# EAGLE board EEZ DIB DCP405 r2B6 (EAGLE 7.2.0), part 1 of 2
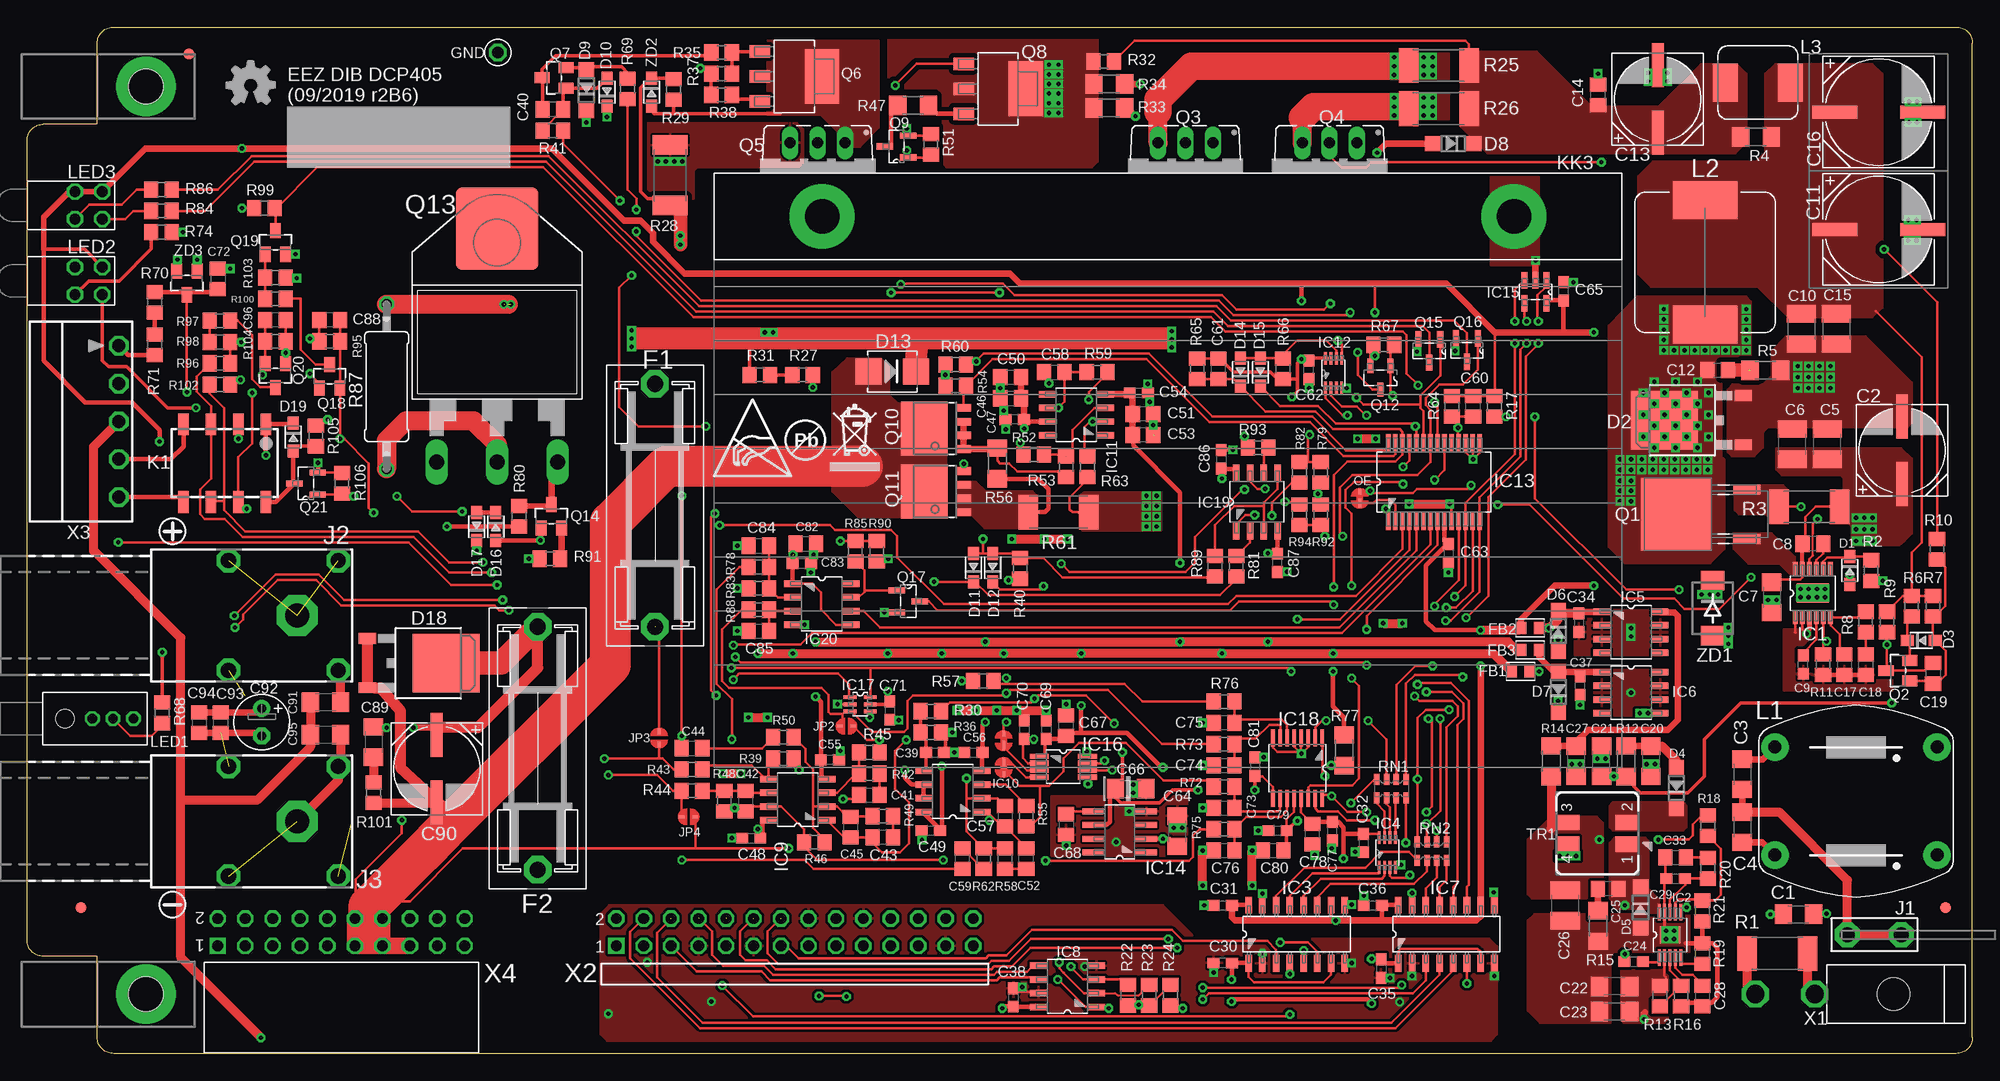
[diagram p6: board, top side]
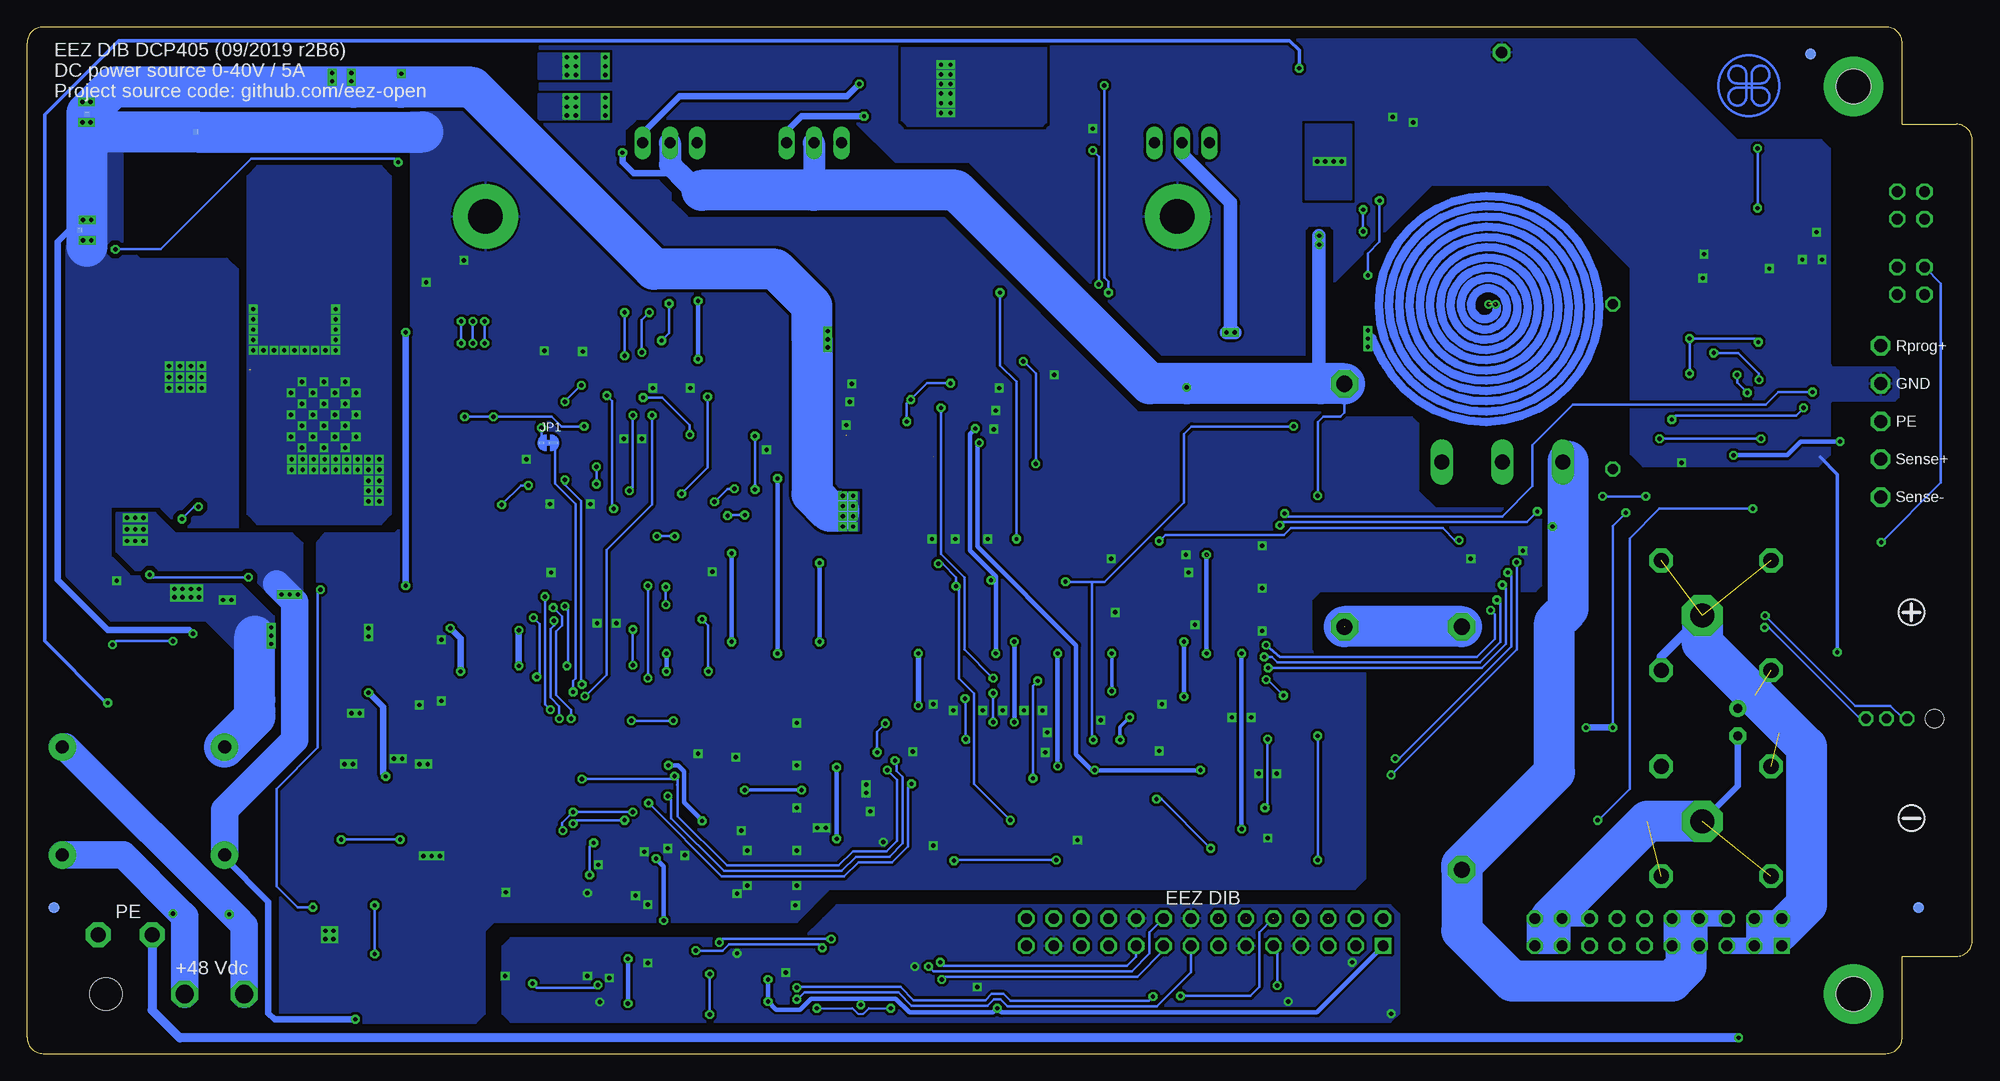
[diagram p7: board, bottom side, seen from below]

Size 180 x 95 mm. Coordinates in mm from the lower left corner, seen from the top.
Outline: 8,95 178.5,95 arc-90 180,93.5 180,1.5 arc-90 178.5,0 8,0 arc-90 6.5,1.5 6.5,9 1.5,9 arc-90 0,10.5 0,84.5 arc-90 1.5,86 6.5,86 6.5,93.5 arc-90 8,95
Copper layers (1*16): Top 0.035mm / dielectric 1.5mm / Bottom 0.035mm
Design rules "default *": minimum track width 6mil, minimum drill 0.3mm, track to track 6mil, track to pad 6mil, pad to pad 6mil, via to via 6mil, smd to smd 6mil, copper to edge 40mil, drill to drill 8mil, minimum pad ring 4mil, minimum via ring 8mil, stop-mask expansion 2.5mil, vias tented up to drill 1mm, thermal gap 8mil
Net classes: 0 default: width 0.203 mm, drill 0.3 mm, clearance 0.203 mm; 1 lvds: width 0.152 mm, drill 0.3 mm, clearance 0.152 mm to class 0, clearance 0.152 mm; 2 gnd: width 0.254 mm, drill 0.584 mm, clearance 0.254 mm

## Footprints (pad centres in the part's own frame; a part is rotated, then mirrored left to right if it is on the bottom)
C1206 = smd 1.6 x 1.8: 1 -1.4,0; 2 1.4,0
CAPAE830X1050N = smd 4.064 x 1.092: + -3.124,0; - 3.124,0
C1210 = smd 1.6 x 2.7: 1 -1.4,0; 2 1.4,0
C0805 = smd 1.3 x 1.5: 1 -0.95,0; 2 0.95,0
C0603 = smd 1.1 x 1: 1 -0.85,0; 2 0.85,0
CAPAE1030X1050N = smd 4.166 x 1.194: + -4.064,0; - 4.064,0
EC1206 = smd 1.6 x 1.8: + -1.4,0; - 1.4,0
ECAP2/5 = drill 0.813 pad 1.6: + -1.27,0 | drill 0.813 pad 1.6 octagon: - 1.27,0
SOD323-R = smd 1.2 x 1: A 1.3,0; C -1.3,0
TO252-L = smd 1 x 1.6: 1 -2.28,-6.07; 2 2.28,-6.07 | smd 5.4 x 6.2: 3 0,1.23
SOD123 = smd 1.4 x 1.4: A 1.9,0; C -1.9,0
SMB = smd 2.4 x 2.4: A 2.2,0; C -2.2,0
ZH32 = drill 1.5 pad 2.54 octagon: 1 -11.25,0; 2 11.25,0
BEAD0603 = smd 1 x 1.1: P$1 -0.85,0; P$2 0.85,0
FIDUCIAL_DUAL = smd 1.016 x 1.016 bottom: B 0,0 | smd 1.016 x 1.016: T 0,0
PCB_SHIELD_TAB = drill 1.1 octagon: 1 0,0
JP2-NOCUT = smd 0.889 x 0.254: 1 -0.445,0 | smd 0.508 x 0.254: 2 0.635,0
LTC_05-08-1666 = smd 1.27 x 0.457: 1 -2.235,1.63; 2 -2.235,0.98; 3 -2.235,0.33; 4 -2.235,-0.33; 5 -2.235,-0.98; 6 -2.235,-1.63; 7 2.235,-1.63; 8 2.235,-0.98; 9 2.235,-0.33; 10 2.235,0.33; 11 2.235,0.98; 12 2.235,1.63 | smd 1.753 x 2.946: TP 0,0
SOP50P490X110-11N = smd 1.549 x 0.279: 1 -2.108,0.991; 2 -2.108,0.508; 3 -2.108,0; 4 -2.108,-0.508; 5 -2.108,-0.991; 6 2.108,-0.991; 7 2.108,-0.508; 8 2.108,0; 9 2.108,0.508; 10 2.108,0.991 | smd 1.575 x 1.88: TP 0,0
SOIC-16 = smd 1.549 x 0.61: 1 -2.692,4.445; 2 -2.692,3.175; 3 -2.692,1.905; 4 -2.692,0.635; 5 -2.692,-0.635; 6 -2.692,-1.905; 7 -2.692,-3.175; 8 -2.692,-4.445; 9 2.692,-4.445; 10 2.692,-3.175; 11 2.692,-1.905; 12 2.692,-0.635; 13 2.692,0.635; 14 2.692,1.905; 15 2.692,3.175; 16 2.692,4.445
DCU8 = smd 1.168 x 0.254: 1 -1.372,0.75; 2 -1.372,0.25; 3 -1.372,-0.25; 4 -1.372,-0.75; 5 1.372,-0.75; 6 1.372,-0.25; 7 1.372,0.25; 8 1.372,0.75
SOIC127P600X173-8N = smd 1.55 x 0.6: 1 -2.7,1.9; 2 -2.7,0.63; 3 -2.7,-0.64; 4 -2.7,-1.91; 5 2.7,-1.91; 6 2.7,-0.64; 7 2.7,0.63; 8 2.7,1.9
SOP65P780X200-28N = smd 1.651 x 0.432: 1 -3.632,4.216; 2 -3.632,3.581; 3 -3.632,2.921; 4 -3.632,2.286; 5 -3.632,1.626; 6 -3.632,0.965; 7 -3.632,0.33; 8 -3.632,-0.33; 9 -3.632,-0.965; 10 -3.632,-1.626; 11 -3.632,-2.286; 12 -3.632,-2.921; 13 -3.632,-3.581; 14 -3.632,-4.216; 15 3.632,-4.216; 16 3.632,-3.581; 17 3.632,-2.921; 18 3.632,-2.286; 19 3.632,-1.626; 20 3.632,-0.965; 21 3.632,-0.33; 22 3.632,0.33; 23 3.632,0.965; 24 3.632,1.626; 25 3.632,2.286; 26 3.632,2.921; 27 3.632,3.581; 28 3.632,4.216
SOIC127P600X175-8N = smd 1.981 x 0.559: 1 -2.464,1.905; 2 -2.464,0.635; 3 -2.464,-0.635; 4 -2.464,-1.905; 5 2.464,-1.905; 6 2.464,-0.635; 7 2.464,0.635; 8 2.464,1.905
SOT23-5 = smd 1.524 x 0.559: 1 -1.079,1.016; 2 -1.079,0; 3 -1.079,-1.016; 4 1.079,-1.016; 5 1.079,1.016
DGK8-M = smd 1.727 x 0.483: 1 -2.235,0.965; 2 -2.235,0.33; 3 -2.235,-0.33; 4 -2.235,-0.965; 5 2.235,-0.965; 6 2.235,-0.33; 7 2.235,0.33; 8 2.235,0.965
SOT65P210X110-6N = smd 1.168 x 0.356: 1 -0.94,0.66; 2 -0.94,0; 3 -0.94,-0.66; 4 0.94,-0.66; 5 0.94,0; 6 0.94,0.66
PW(R-PDSO-G16) = smd 1.6 x 0.35: 1 -2.8,2.3; 2 -2.8,1.65; 3 -2.8,1; 4 -2.8,0.35; 5 -2.8,-0.3; 6 -2.8,-0.95; 7 -2.8,-1.6; 8 -2.8,-2.25; 9 2.8,-2.25; 10 2.8,-1.6; 11 2.8,-0.95; 12 2.8,-0.3; 13 2.8,0.35; 14 2.8,1; 15 2.8,1.65; 16 2.8,2.3
PCB_TAB-4907 = drill 1.4 pad 2.3 octagon: 1 -2.5,0; 2 2.5,0
S16N-PC = drill 2.2 pad 3.81 octagon: 1 0,0 | drill 1.4 pad 2.184 octagon: NC1 -3.8,5.08; NC2 -3.8,-5.08; NC3 6.36,5.08; NC4 6.36,-5.08
JP2-CUT = smd 0.508 x 0.254: 1 -0.635,0; 2 0.635,0
G6K-2F = smd 1 x 2: 1 -3.81,-3.6; 2 -1.27,-3.6; 3 1.27,-3.6; 4 3.81,-3.6; 5 3.81,3.6; 6 1.27,3.6; 7 -1.27,3.6; 8 -3.81,3.6
PCB-MB = hole 3.2: 0,0
SK96/84 = drill 3.2 pad 6: 1 10,4; 2 74,4
RN112 = drill 1.2 pad 2.54: 1 -7.5,5; 2 7.5,5; 3 -7.5,-5; 4 7.5,-5
125CDMCC/DS = smd 3.5 x 6: 1 -5.75,0; 2 5.75,0
COILCRAFT_HPI0630 = smd 2.3 x 3.5: 1 -3,0; 2 3,0
L-42WUM-1EGWT = drill 0.9 octagon: CC 4.445,0; GREEN 6.35,0; RED 2.54,0 | hole 1.7: 0,0
WP934MD = drill 1 octagon: BA -1.27,1.27; BC -1.27,-1.27; TA 1.27,1.27; TC 1.27,-1.27
TO229P990X239-3N = smd 0.94 x 2.489: 1 -2.286,-6.401; 3 2.286,-6.401 | smd 6.731 x 6.528: 2 0,0.152
SOT23-BEC = smd 1 x 1.4: B -0.95,-1.1; C 0,1.1; E 0.95,-1.1
TO220FP-V = drill 1.016 long: 1 -2.54,-0.203; 2 0,-0.203; 3 2.54,-0.203
SOT230P700X180-4N = smd 1.905 x 1.143: 1 -3.2,2.311; 2 -3.2,0; 3 -3.2,-2.311 | smd 3.175 x 5.08: 4 2.565,0
SOT103P240X110-3N = smd 1.524 x 0.559: 1 -1.079,1.016; 2 -1.079,-1.016; 3 1.079,0
SOT669 = smd 0.7 x 1.4: 1 -1.905,-2.65; 2 -0.635,-2.65; 3 0.635,-2.65; 4 1.905,-2.65 | smd 5 x 4.3: MB 0,1
SOT95P237X112-3N = smd 1.321 x 0.559: 1 -1.092,0.94; 2 -1.092,-0.94; 3 1.092,0
TOP3_TRIAC_NOHOLE = drill 1.397 long: A1 -5.588,-20.32; A2 0,-20.32; G 5.588,-20.32 | smd 7.62 x 7.62: NC 0,1.27
R2512 = smd 1.8 x 3.2: 1 -2.8,0; 2 2.8,0
R0805 = smd 1.3 x 1.5: 1 -0.95,0; 2 0.95,0
R1206 = smd 1.6 x 1.803: 1 -1.422,0; 2 1.422,0
R_2512-4WIRE = smd 1.8 x 3.2: 1 -2.8,0; 2 2.8,0 | smd 1.27 x 0.254: 1S -2.413,0; 2S 2.413,0
0411/15 = drill 0.914 octagon: 1 -7.62,0; 2 7.62,0
CAY16 = smd 0.5 x 1: 1 -1.35,-0.85; 2 -0.45,-0.85; 3 0.45,-0.85; 4 1.35,-0.85; 5 1.35,0.85; 6 0.45,0.85; 7 -0.45,0.85; 8 -1.35,0.85
SHORT_NOHOLE = smd 0.5 x 0.25 bottom: 1 0,0.117; 2 0,-0.117
SRF0703 = smd 1.4 x 2.1: 1 1,2.7; 2 -1,2.7; 3 -1,-2.7; 4 1,-2.7
MINIFIT_39301020 = drill 1.7 octagon: 1 0,0; 2 0,5.5 | hole 3: 0,-7.3
77317-104-28LF = drill 1 pad 1.5 square: 1 -33.02,-2.54 | drill 1 pad 1.5 octagon: 2 -33.02,0; 3 -30.48,-2.54; 4 -30.48,0; 5 -27.94,-2.54; 6 -27.94,0; 7 -25.4,-2.54; 8 -25.4,0; 9 -22.86,-2.54; 10 -22.86,0; 11 -20.32,-2.54; 12 -20.32,0; 13 -17.78,-2.54; 14 -17.78,0; 15 -15.24,-2.54; 16 -15.24,0; 17 -12.7,-2.54; 18 -12.7,0; 19 -10.16,-2.54; 20 -10.16,0; 21 -7.62,-2.54; 22 -7.62,0; 23 -5.08,-2.54; 24 -5.08,0; 25 -2.54,-2.54; 26 -2.54,0; 27 0,-2.54; 28 0,0
MC1,5/5-G-3,5 = drill 1.2 octagon: 1 -7,0; 2 -3.5,0; 3 0,0; 4 3.5,0; 5 7,0
SSW-110-02-T-D-RA = drill 1 pad 1.5 square: 1 22.86,2.54 | drill 1 pad 1.5 octagon: 2 22.86,0; 3 20.32,2.54; 4 20.32,0; 5 17.78,2.54; 6 17.78,0; 7 15.24,2.54; 8 15.24,0; 9 12.7,2.54; 10 12.7,0; 11 10.16,2.54; 12 10.16,0; 13 7.62,2.54; 14 7.62,0; 15 5.08,2.54; 16 5.08,0; 17 2.54,2.54; 18 2.54,0; 19 0,2.54; 20 0,0
DO214AA = smd 1.8 x 2.2: A 2.55,0; C -2.55,0
SOT23 = smd 1 x 1.4: 1 -0.95,-1.1; 2 0.95,-1.1; 3 0,1.1

## Placement (x,y rotation side)
C1  10n/200V  [C1206]  163.89,12.89 0 top
C2  HHXC630A330MHA0G  [CAPAE830X1050N]  173.48,55.82 90 top
C3  10n/200V  [C1206]  158.69,25.84 270 top
C4  10n/200V  [C1206]  158.69,20.95 270 top
C5  4u7/100V  [C1210]  166.56,56.39 90 top
C6  4u7/100V  [C1210]  163.32,56.39 90 top
C7  1u/100V  [C1206]  161.42,42.23 270 top
C8  470n  [C0805]  165.23,47.18 180 top
C9  100n  [C0603]  164.34,36 90 top
C10  10u  [C1210]  164.15,67.06 270 top
C11  EEEFK1J101P  [CAPAE1030X1050N]  171.32,76.26 0 top
C12  470p  [C0805]  156.4,63.25 0 top
C13  EEEFK1H470P  [CAPAE830X1050N]  150.88,88.33 90 top
C14  N.C.  [C0805]  145.35,88.71 90 top
C15  10u  [C1210]  167.39,67.06 270 top
C16  EEEFK1J101P  [CAPAE1030X1050N]  171.32,87.12 0 top
C17  33p  [C0805]  168.15,36 270 top
C18  6n8  [C0805]  170.12,36 270 top
C19  470p  [C0805]  176.34,35.18 270 top
C20  4u7  [C1206]  150.24,27.05 270 top
C21  4u7  [C1206]  145.67,27.05 90 top
C22  2u2  [C1206]  146.88,6.22 180 top
C23  2u2  [C1206]  146.88,3.87 180 top
C24  100n  [C0603]  148.65,8.51 0 top
C25  330p  [C0805]  146.3,15.24 180 top
C26  22u  [C1210]  142.3,13.72 270 top
C27  4u7  [C1206]  143.32,27.05 270 top
C28  10n  [C0805]  155,5.33 270 top
C29  33p  [C0603]  152.53,16.19 0 top
C30  100n  [C0603]  110.62,8.38 180 top
C31  100n  [C0603]  110.62,13.72 0 top
C32  100n  [C0603]  123.63,19.49 270 top
C33  10n  [C0805]  152.53,18.16 0 top
C34  100n  [C0603]  143.57,39.88 270 top
C35  100n  [C0603]  125.29,7.87 270 top
C36  100n  [C0603]  124.52,13.72 0 top
C37  100n  [C0603]  143.7,34.04 90 top
C38  100n  [C0603]  91.25,5.21 270 top
C39  100n  [C0603]  84.01,27.88 0 top
C40  470p  [C0805]  48.64,87.38 180 top
C41  1n  [C0805]  77.91,23.94 0 top
C42  33p  [C0805]  66.48,23.37 270 top
C43  330p  [C0805]  79.18,20 180 top
C44  1n  [C0805]  61.53,28.26 0 top
C45  33p  [C0805]  76.2,20.95 270 top
C46  10n  [C0805]  91,60.64 0 top
C47  100n  [C0603]  91.38,58.67 180 top
C48  100n  [C0603]  66.99,19.94 0 top
C49  100n  [C0603]  83.63,20.64 0 top
C50  1u  [C0805]  91,62.61 0 top
C51  10n  [C0805]  103.25,59.18 180 top
C52  6n8  [C0805]  92.46,18.03 90 top
C53  1u  [C0805]  103.25,57.23 180 top
C54  100n  [C0603]  102.87,61.15 0 top
C55  100n  [C0603]  74.3,27.18 180 top
C56  100n  [C0603]  87.57,27.88 0 top
C57  33p  [C0805]  90.49,21.97 270 top
C58  33p  [C0805]  95.06,63.06 0 top
C59  4n7  [C0805]  86.55,18.03 90 top
C60  330p  [C0805]  133.79,59.88 90 top
C61  1n  [C0805]  110.24,63.37 90 top
C62  100n  [C0603]  118.59,63.28 90 top
C63  100n  [C0603]  131.51,46.29 270 top
C64  4u7  [C1206]  106.43,20.57 90 top
C65  100n  [C0603]  142.18,70.55 90 top
C66  4u7 tant.  [EC1206]  102.11,24.51 0 top
C67  1u  [C0805]  96.14,30.35 90 top
C68  1u  [C0805]  96.14,21.21 270 top
C69  100n  [C0603]  94.3,29.97 270 top
C70  100n  [C0603]  92.27,29.97 270 top
C71  100n  [C0603]  79.82,31.75 270 top
C72  10n  [C0805]  17.65,71.69 270 top
C73  4n7  [C0805]  110.74,22.73 0 top
C74  4n7  [C0805]  110.74,26.67 0 top
C75  4n7  [C0805]  110.74,30.61 180 top
C76  4n7  [C0805]  110.74,18.8 0 top
C77  100n  [C0603]  120.78,20.57 90 top
C78  1u  [C0805]  118.94,20.32 90 top
C79  100n  [C0603]  115.7,20.64 0 top
C80  1u  [C0805]  115.32,18.8 0 top
C81  100n  [C0603]  113.6,26.54 270 top
C82  N.C.  [C0805]  72.07,47.18 0 top
C83  100n  [C0603]  71.69,45.34 180 top
C84  1n  [C0805]  67.69,46.99 0 top
C85  1n  [C0805]  67.69,39.12 0 top
C86  100n  [C0603]  110.49,54.99 270 top
C87  100n  [C0603]  115.7,45.4 90 top
C88  10n  [C0805]  28,67.88 180 top
C89  470n  [C1206]  32.07,28.83 270 top
C90  HHXC630A330MHA0G  [CAPAE830X1050N]  37.91,26.35 270 top
C91  10n/200V  [C1206]  27.62,32.51 180 top
C92  N.C.  [ECAP2/5]  21.72,30.67 270 top
C93  N.C.  [C0805]  17.91,30.61 270 top
C94  N.C.  [C0805]  15.94,30.61 270 top
C95  10n/200V  [C1206]  27.62,29.53 0 top
C96  10n  [C0805]  22.99,67.88 180 top
D1  BAS316  [SOD323-R]  168.66,44.7 270 top
D2  STPS15H100  [TO252-L]  152.72,58.61 90 top
D3  BAS316  [SOD323-R]  175.26,38.23 0 top
D4  SKL16  [SOD123]  152.59,24.57 90 top
D5  SKL16  [SOD123]  149.29,13.53 270 top
D6  SKL14  [SOD123]  141.67,39.12 270 top
D7  SKL14  [SOD123]  141.67,33.46 90 top
D8  N.C.  [SOD123]  131.95,84.2 180 top
D9  SKL14  [SOD123]  51.75,89.15 90 top
D10  BAS316  [SOD323-R]  53.66,88.96 90 top
D11  BAS316  [SOD323-R]  87.57,44.96 90 top
D12  BAS316  [SOD323-R]  89.34,44.96 90 top
D13  SK55  [SMB]  80.07,63.12 180 top
D14  BAS316  [SOD323-R]  112.27,63.06 90 top
D15  BAS316  [SOD323-R]  114.11,63.06 90 top
D16  BAS316  [SOD323-R]  43.37,48.77 270 top
D17  BAS316  [SOD323-R]  41.59,48.77 90 top
D18  SK10100D1-DIO  [TO252-L]  37.56,36.13 270 top
D19  BAS316  [SOD323-R]  24.64,57.05 270 top
EEZ_SIGNATURE  SIGNATURESMALL  [SIGNATURE_5MM]  20.68,89.58 180 top
F1  ZH32  [ZH32]  58.1,50.74 270 top
F2  ZH32  [ZH32]  47.24,28.26 270 top
FB1  60R@100MHz  [BEAD0603]  138.18,35.37 180 top
FB2  60R@100MHz  [BEAD0603]  139.06,39.37 180 top
FB3  60R@100MHz  [BEAD0603]  139.06,37.34 180 top
FM1  FIDUCIAL_2  [FIDUCIAL_DUAL]  15,92.5 0 top
FM2  FIDUCIAL_2  [FIDUCIAL_DUAL]  177.5,13.5 0 top
FM3  FIDUCIAL_2  [FIDUCIAL_DUAL]  5,13.5 0 top
GND  [PCB_SHIELD_TAB]  43.56,92.65 0 top
I_SET  JP2-NOCUT  [JP2-NOCUT]  90.36,26.48 270 top
IC1  LTC3864EMSE#PBF  [LTC_05-08-1666]  165.23,42.61 90 top
IC2  TPS54060DGQ  [SOP50P490X110-11N]  152.02,10.99 90 top
IC3  SI8641BB-B-IS1  [SOIC-16]  117.47,11.05 90 top
IC4  SN74LVC1G139DCUR  [DCU8]  125.86,18.61 90 top
IC5  MC78L05  [SOIC127P600X173-8N]  148.4,38.99 0 top
IC6  MC79L05  [SOIC127P600X173-8N]  148.4,33.4 0 top
IC7  SI8641BB-B-IS1  [SOIC-16]  131.32,11.05 90 top
IC8  M24C32-WMN6P  [SOIC127P600X173-8N]  96.27,6.22 180 top
IC9  MC33272ADR2G  [SOIC127P600X173-8N]  71.31,23.5 180 top
IC10  MC33272ADR2G  [SOIC127P600X173-8N]  85.66,24.26 180 top
IC11  LTC2050HVCS8#PBF  [SOIC127P600X173-8N]  97.09,59.12 180 top
IC12  74AUP1G74DC.125  [DCU8]  120.89,62.98 90 top
IC13  MCP23S17-E/SS  [SOP65P780X200-28N]  130.18,52.9 90 top
IC14  REF5025AIDR  [SOIC127P600X175-8N]  101.09,20.51 180 top
IC15  TC77-5.0MCTTR  [SOT23-5]  139.57,70.48 270 top
IC16  DAC8552IDGKR  [DGK8-M]  95.89,26.54 0 top
IC17  SN74LVC1G3157DCKR  [SOT65P210X110-6N]  77.09,32.32 0 top
IC18  ADS1120IPWR  [PW(R-PDSO-G16)]  117.54,26.42 270 top
IC19  LM293D  [SOIC127P600X173-8N]  113.79,51.05 90 top
IC20  MAX9141ESA  [SOIC127P600X173-8N]  73.53,41.59 0 top
J1  4907  [PCB_TAB-4907]  170.92,11 180 top
J2  FCR7350R  [S16N-PC]  25,40.55 180 top
J3  FCR7350B  [S16N-PC]  25,21.5 180 top
JP1  JP2-NOCUT  [JP2-NOCUT]  131.76,56.52 180 bottom
JP2  JP2-CUT  [JP2-CUT]  75.82,30.29 0 top
JP3  JP2-CUT  [JP2-CUT]  58.48,29.21 90 top
JP4  JP2-CUT  [JP2-CUT]  61.21,21.91 180 top
K1  G6K-2F-5DC  [G6K-2F]  18.29,54.64 180 top
KK1  PCB-MB-01  [PCB-MB]  11,89.5 0 top
KK2  PCB-MB-01  [PCB-MB]  11,5.5 0 top
KK3  SK96/84  [SK96/84]  147.57,81.47 180 top
L1  RN112-4-02-0M7  [RN112]  169.23,23.37 180 top
L2  125CDMCCDS-330MC  [125CDMCC/DS]  155.26,73.22 90 top
L3  VLS6045AF-3R3N  [COILCRAFT_HPI0630]  160.15,89.85 180 top
LED1  WP42WUM/EGW  [L-42WUM-1EGWT]  3.5,31 0 top
LED2  WP934MD/2LID  [WP934MD]  5.7,71.5 0 top
LED3  WP934MD/LYLID  [WP934MD]  5.7,78.5 0 top
OE  JP2-NOCUT  [JP2-NOCUT]  123.32,51.37 90 top
Q1  SUD19P06-60  [TO229P990X239-3N]  152.72,49.91 90 top
Q2  MMBT5401  [SOT23-BEC]  173.1,35.43 90 top
Q3  D45H11FP  [TO220FP-V]  107.19,84.07 180 top
Q4  D45H11FP  [TO220FP-V]  120.52,84.07 180 top
Q5  FQPF11P06 or FQPF27P06  [TO220FP-V]  73.15,84.07 180 top
Q6  BCP56-16.115  [SOT230P700X180-4N]  70.99,90.42 0 top
Q7  MMBT5401  [SOT23-BEC]  48.77,90.3 90 top
Q8  NZT605  [SOT230P700X180-4N]  89.85,89.28 0 top
Q9  BSS205NH6327XTSA1  [SOT103P240X110-3N]  80.45,83.95 180 top
Q10  PSMN0R9-25YLC  [SOT669]  84.01,57.85 90 top
Q11  PSMN0R9-25YLC  [SOT669]  84.01,52.01 90 top
Q12  BSS84P  [SOT95P237X112-3N]  125.22,62.55 270 top
Q13  BTA26-600  [TOP3_TRIAC_NOHOLE]  43.5,75.06 0 top
Q14  FMMT493TA  [SOT23-BEC]  48.51,49.72 0 top
Q15  2N7002  [SOT103P240X110-3N]  129.73,65.02 270 top
Q16  2N7002  [SOT103P240X110-3N]  133.22,65.09 270 top
Q17  2N7002  [SOT103P240X110-3N]  81.53,41.85 0 top
Q18  MMBT5401  [SOT23-BEC]  28,62.67 0 top
Q19  MMBT5551  [SOT23-BEC]  22.99,75.06 0 top
Q20  MMBT5551  [SOT23-BEC]  22.99,62.74 180 top
Q21  2N7002  [SOT103P240X110-3N]  25.81,52.77 180 top
R1  N.C.  [R2512]  161.93,9.27 0 top
R2  10K  [R0805]  170.62,44.7 90 top
R3  R008/2-3W  [R2512]  164.91,50.61 180 top
R4  15R  [R1206]  159.96,84.84 180 top
R5  10R  [R1206]  160.85,63.25 180 top
R6  10K  [R0805]  174.37,41.4 270 top
R7  100K  [R0805]  176.34,41.4 270 top
R8  1K  [R0805]  170.12,39.94 90 top
R9  330K  [R0805]  172.09,39.94 270 top
R10  100K  [R0805]  176.72,46.67 90 top
R11  4K7  [R0805]  166.18,36 270 top
R12  10R  [R1206]  147.96,27.05 90 top
R13  47K  [R0805]  151.07,5.33 90 top
R14  10R  [R1206]  141.03,27.05 270 top
R15  10R  [R1206]  145.35,11.81 90 top
R16  2K2  [R0805]  153.03,5.33 90 top
R17  10K  [R0805]  135.76,59.88 270 top
R18  100K  [R0805]  155.51,21.08 90 top
R19  330K  [R0805]  155,9.27 270 top
R20  86K6  [R0805]  155.51,17.14 270 top
R21  10K  [R0805]  155,13.21 90 top
R22  10K  [R0805]  101.85,5.4 90 top
R23  10K  [R0805]  103.82,5.4 90 top
R24  10K  [R0805]  105.79,5.4 270 top
R25  0R1/2-3W  [R2512]  130.62,91.44 180 top
R26  0R1/2-3W  [R2512]  130.62,87.44 180 top
R27  4K7  [R0805]  71.75,62.8 0 top
R28  2R2/2W  [R2512]  59.5,81.28 270 top
R29  4K7  [R0805]  59.82,89.22 270 top
R30  10K  [R0805]  83.63,31.69 180 top
R31  4K7  [R0805]  67.82,62.8 0 top
R32  2K2  [R0805]  99.63,91.82 0 top
R33  10R  [R1206]  100.14,87.5 0 top
R34  10R  [R1206]  100.14,89.73 0 top
R35  5K6  [R0805]  64.26,92.65 180 top
R36  220R  [R0805]  83.63,29.72 0 top
R37  1K  [R0805]  64.26,90.68 180 top
R38  220R  [R0805]  64.26,88.71 180 top
R39  7K5 0.1%  [R0805]  69.98,27.3 180 top
R40  2K2  [R0805]  91.88,44.89 270 top
R41  22K  [R0805]  48.64,85.41 180 top
R42  4K7  [R0805]  77.91,25.91 180 top
R43  124K 0.1%  [R0805]  61.53,26.29 180 top
R44  124K 0.1%  [R0805]  61.53,24.32 180 top
R45  10K  [R0805]  77.91,27.88 180 top
R46  10K  [R0805]  72.83,19.56 0 top
R47  15R  [R1206]  81.98,87.76 0 top
R48  7K5 0.1%  [R0805]  64.52,23.37 90 top
R49  2K2  [R0805]  79.18,21.97 0 top
R50  4K7  [R0805]  69.98,29.27 0 top
R51  100K  [R0805]  83.63,84.14 270 top
R52  39K 0.1%  [R0805]  93.15,55.44 0 top
R53  820R 0.1%  [R0805]  96.14,54.29 90 top
R54  47K  [R0805]  85.92,61.79 0 top
R55  2K2  [R0805]  92.46,21.97 90 top
R56  1R  [R1206]  89.79,54.61 270 top
R57  10K  [R0805]  88.46,34.48 180 top
R58  1K  [R0805]  90.49,18.03 90 top
R59  39K 0.1%  [R0805]  99,63.06 180 top
R60  47K  [R0805]  85.92,63.75 0 top
R61  0R010 (low TCR)  [R_2512-4WIRE]  95.44,50.1 180 top
R62  10K  [R0805]  88.52,18.03 90 top
R63  820R 0.1%  [R0805]  98.11,54.29 90 top
R64  1K  [R0805]  131.83,59.88 270 top
R65  4K7  [R0805]  108.27,63.37 270 top
R66  10K  [R0805]  116.2,63.37 90 top
R67  100K  [R0805]  125.54,65.6 0 top
R68  270R  [R0805]  12.51,31.53 90 top
R69  2K2  [R0805]  55.56,89.28 270 top
R70  470R  [R0805]  11.81,69.53 270 top
R71  470R  [R0805]  11.81,65.6 270 top
R72  2K2  [R0805]  110.74,24.7 0 top
R73  2K2  [R0805]  110.74,28.64 0 top
R74  470R  [R0805]  12.45,76.01 180 top
R75  2K2  [R0805]  110.74,20.76 0 top
R76  2K2  [R0805]  110.74,32.58 0 top
R77  10R  [R1206]  121.86,28.07 270 top
R78  330R  [R0805]  67.69,45.02 0 top
R79  4K7  [R0805]  119.7,53.78 270 top
R80  470R  [R0805]  45.53,49.72 270 top
R81  10K  [R0805]  111.89,45.09 90 top
R82  4K7  [R0805]  117.73,53.78 90 top
R83  10K  [R0805]  67.69,43.05 180 top
R84  330R  [R0805]  12.45,77.98 0 top
R85  1K  [R0805]  76.64,46.48 270 top
R86  330R  [R0805]  12.45,79.95 180 top
R87  AC01000002207JA100  [0411/15]  33.27,61.72 270 top
R88  10K  [R0805]  67.69,41.08 0 top
R89  10K  [R0805]  109.92,45.09 270 top
R90  100K  [R0805]  78.61,46.48 90 top
R91  6R2  [R0805]  48.39,45.78 0 top
R92  4K7  [R0805]  119.7,49.85 90 top
R93  10K  [R0805]  113.92,56.07 0 top
R94  4K7  [R0805]  117.73,49.85 270 top
R95  330R  [R0805]  28,65.91 0 top
R96  750R  [R0805]  17.84,63.88 0 top
R97  1K  [R0805]  17.84,67.82 180 top
R98  2K2  [R0805]  17.84,65.85 0 top
R99  10K  [R0805]  21.97,78.23 180 top
R100  10K  [R0805]  22.99,69.85 0 top
R101  1R  [R0805]  32.07,24.13 90 top
R102  750R  [R0805]  17.84,61.91 180 top
R103  47K  [R0805]  22.99,71.82 180 top
R104  330R  [R0805]  22.99,65.91 0 top
R105  470R  [R0805]  26.73,57.15 90 top
R106  100K  [R0805]  29.15,52.77 270 top
RN1  DR1206-33R-4/8  [CAY16]  126.24,24.51 0 top
RN2  DR1206-33R-4/8  [CAY16]  129.98,18.73 0 top
SH1  [SHORT_NOHOLE]  164.4,85.28 270 top
SH2  Pgnd to Pout- short  [SHORT_NOHOLE]  174.43,86.93 0 top
SH3  Sgnd to Pgnd short  [SHORT_NOHOLE]  175.13,76.2 270 top
TR1  SRF0703-821M  [SRF0703]  145.29,20.38 270 top
U$1  [RECYCLE_BIN1/8]  74.3,53.91 0 top
U$6  [ESD_SYMBOL]  63.59,53.43 0 top
U$7  [PB_SMALL]  72.01,56.77 0 top
U_SET  JP2-NOCUT  [JP2-NOCUT]  90.36,28.96 90 top
X1  39-30-1020  [MINIFIT_39301020]  165.41,5.5 90 top
X2  77317-104-28LF  [77317-104-28LF]  87.54,12.5 0 top
X3  1844249  [MC1,5/5-G-3,5]  8.5,58.5 270 top
X4  DS1024-2*10R0  [SSW-110-02-T-D-RA]  40.5,12.5 180 top
ZD1  SMAJ51A  [DO214AA]  155.96,41.21 270 top
ZD2  MM3Z9V1T1G  [SOD323-R]  57.78,88.96 270 top
ZD3  SLVU2.8-TP  [SOT23]  14.8,71.31 180 top

## Tracks (layer width: path | path; a pad name or v marks a point on that pad's centre or on a via)
5A_S
  pour Top (isolate 0.254, no thermals): 85.98,52.9 87.82,52.9 88.71,52.01 93.03,52.01 93.41,51.63 93.41,48.64 88.58,48.64 87.38,49.85 85.98,49.85
50MA_S
  Top 0.254: R56.1 89.79,54.86 90.04,54.61 90.87,54.61 91.63,53.85 95.89,53.85 96.14,53.59 R53.1
  Top 0.61: Q10.3 Q10.2 Q10.1 89.24,55.94 R56.1
!ADC_DRDY  (via drill 0.4)
  Top 0.254: IC18.14 118.54,24.62 118.75,24.83 122.62,24.83 123.25,25.46 123.25,34.04 v122.56,34.73 | v127.32,52.7 127.13,52.9 122.75,52.9 121.98,52.13 121.98,50.55 122.56,49.97 v122.56,43.31 | IC13.25 127.89,54.86 v127.32,54.29
  Bottom 0.254: v127.32,54.29 v127.32,52.7 | v122.56,43.31 v122.56,34.73
!DP_DRIVE
  Top 0.305: R69.1 55.56,90.74 54.99,91.31 52.01,91.31 D9.A 51.56,91.25 Q7.E
!IOEXP_RST  (via drill 0.4)
  Top 0.254: IC13.18 132.4,56.59 v132.4,57.91 132.4,58.36 R64.2 C60.1
  Bottom 0.254: JP1.2 v132.4,57.91
!OVP_FAULT  (via drill 0.4)
  Top 0.254: Q17.3 83.44,41.85 84.26,41.02 111.32,41.02 112.14,41.85 120.59,41.85 v120.9,41.53 | v120.9,43.18 120.9,53.53 122.17,54.8 126.62,54.8 127.25,55.44 IC13.26 127.25,57.53 127,57.78 120.84,57.78 119.19,59.44 114.59,59.44 D14.C 111.6,62.42 C61.1 R65.2
  Bottom 0.254: v120.9,41.53 v120.9,43.18
!RESET  (via drill 0.4)
  Top 0.254: IC7.12 131.95,15.43 132.33,15.81 132.33,30.42 132.91,30.99 132.91,32.38 131.83,33.47 v129.48,33.47
  Bottom 0.254: v129.48,33.47 129.48,34.48 129.22,34.73 129.22,50.86 131.13,52.77 131.13,56.33 JP1.1
!SET_DP  (via drill 0.4)
  Top 0.254: IC13.1 125.96,50.19 v125.73,50.42 | R67.2 126.16,65.52 Q12.1 126.16,61.1 v126.36,60.9
  Bottom 0.254: v125.73,50.42 125.86,50.55 125.86,60.39 v126.36,60.9
+3V3  (via drill 0.4)
  Top 0.203: R23.1 103.89,4.45 R24.1
  Top 0.254: IC7.7 134.49,9.4 134.18,9.72 127.13,9.72 126.87,9.46 IC7.1 | R22.1 102.68,4.45 v102.87,4.51 103.06,4.45 R23.1 | IC3.7 120.65,7.3 119.95,6.6 113.54,6.6 113.03,7.11 IC3.1
  Top 0.406: IC7.1 125.33,8.36 C35.1 v124.4,8.76 | C38.2 91.29,4.6 | IC8.8 91.6,4.32 C38.2 | C38.2 90.4,4.36 v90.23,4.19 | 111.51,8.22 C30.1 | v124.4,4.64 124.02,5.02 111.63,5.02 v111.44,4.83 | IC3.1 113,8.38 C30.1 | v111.44,6.86 111.47,6.88 C30.1
  Bottom 0.254: v102.87,4.51 102.87,5.08
  Bottom 0.406: v124.4,4.64 v124.4,8.76 | v111.44,6.86 v111.44,4.83 110.68,4.06 108.46,4.06 107.44,5.08 102.87,5.08 99.63,5.08 98.36,3.81 90.61,3.81 v90.23,4.19 89.85,3.81 60.67,3.81 X2.1
+5V  (via drill 0.4)
  Top 0.254: IC12.8 IC12.7 | IC3.10 120.65,12.38 v121.09,12.32 | IC18.13 117.89,22.32 C78.2 | R99.2 v19.88,78.23 | 138.3,66.67 138.24,66.74 | Q12.2 124.28,65.54 R67.1 124.59,64.7 v124.71,64.58 | R79.2 119.44,52.58 v119.44,51.82 119.44,50.54 R92.2 | 123.74,20.32 125.11,20.32 IC4.8 | v124.71,68.58 124.71,71.25 | R64.1 C60.2 R17.1 135.83,60.89 135.83,66.74 | R65.1 C61.2
  Top 0.305: R99.2 21.02,77.85 | IC15.5 140.59,69.72 | IC12.8 118.81,64.35 C62.2 118.3,64.13 | 1.52,74.42 5.32,74.42 LED2.TA | 117.54,62.42 117.54,63.88 v117.92,64.26 | 117.54,62.42 117.54,61.28 v117.03,60.77 | 117.54,62.42 R66.1 115.69,62.42 115.06,63.06 111.63,63.06 110.62,64.07 110.55,64.07 110.3,64.32 C61.2
  Top 0.406: D19.C 24.52,58.24 K1.1 v22.1,55.37 | v12.26,56.64 12.26,57.72 9.72,60.26 5.4,60.26 1.52,64.14 1.52,74.42 | IC7.16 125.4,13.74 C36.2 125.37,12.41 125.28,12.32 | IC3.16 111.49,13.74 C31.2 | C78.2 119.09,21.42 C77.2 121.32,21.42 121.79,20.95 121.79,20.32 | v121.79,18.03 121.79,20.32 | C32.1 123.74,20.32 121.79,20.32 | C63.1 131.47,47.01 131.28,47.01 129.41,45.15 129.41,40.01 130.24,39.18 v134.49,39.18 | IC13.9 131.14,47.38 C63.1 | 142.15,69.72 142.15,66.89 142.3,66.74 | 140.59,69.72 142.15,69.72 | 142.15,69.72 C65.1 | v117.92,69.66 117.92,71.25 | v117.92,64.26 118.62,64.16 C62.2 | C63.1 131.41,47.14
  Top 0.508: 1.52,74.42 1.52,77.41 3.89,79.77 LED3.BA LED3.TA
  Top 0.61: C31.2 111.47,12.61 111.76,12.32 v121.09,12.32 125.28,12.32 134.11,12.32 134.49,12.7 IC7.10 v134.49,35.88 | FB2.P$2 138.22,40.17 141.35,43.31 v144.97,43.31 | LED3.TA 10.96,83.76 v19.88,83.76 48.58,83.76 55.24,77.09 56.77,77.09 57.91,75.95 57.91,75.12 60.83,72.2 90.93,72.2 91.89,71.25 117.92,71.25 124.71,71.25 131.32,71.25 135.83,66.74 138.24,66.74 142.3,66.74 v144.97,66.74
  Top 0.813: v134.49,39.18 138.02,39.18 FB2.P$2
  Bottom 0.254: v19.88,78.23 v19.88,83.76 | v124.71,64.58 v124.71,68.58 | v117.03,60.77 117.03,54.23 v119.44,51.82
  Bottom 0.406: v22.1,55.37 17.14,55.37 15.88,56.64 v12.26,56.64 | v121.09,12.32 121.09,17.34 v121.79,18.03 | v117.92,64.26 v117.92,69.66
  Bottom 0.61: v144.97,66.74 v144.97,43.31 | v134.49,35.88 v134.49,39.18
+5VOUT  (via drill 0.4)
  Top 0.61: IC5.1 143.73,40.89 C34.1 | FB1.P$1 v139.89,35.37
  Top 0.813: FB2.P$1 139.89,39.4 v140.84,39.37 141.67,40.2 D6.C 141.77,40.73 C34.1
  Bottom 0.61: v139.89,35.37 139.89,38.42 v140.84,39.37
+VNR
  Top 0.61: IC5.8 151.16,40.83 152.4,40.83 152.72,40.51 152.72,30.86 151.83,29.97 144.46,29.97 143.32,28.83 C27.1 | C27.1 143.7,28.45 143.89,28.64 | R14.1 143.3,28.47 C27.1
+VREF  (via drill 0.4)
  Top 0.254: IC18.9 115.25,23.65 115.25,24.7 114.33,25.63 113.67,25.63 C81.2 113.51,26.1 | v100.58,30.54 97.98,33.15 93.53,33.15 v93.22,32.83 92.9,32.51 85.41,32.51 R30.1 | 92.2,29.06 C70.2 92.14,29 92.14,27.37 92.63,26.87 IC16.2
  Top 0.305: 100.14,24.7 100.39,24.45 100.39,24.19 100.39,24 | 100.39,24 101.22,23.18 104.78,23.18 105.98,24.38 v108.33,24.38 | v113.6,24.38 C81.2 | 100.58,24.7 100.39,24.51 C66.+ 101.35,25.15 v101.35,27.88 | 100.39,24 100.33,24 100.14,23.81 | v93.15,29.08 92.37,29.08 C70.2
  Top 0.406: 100.39,24.19 C66.+ 100.2,24.45 100.2,21.46 99.89,21.14 IC14.6
  Bottom 0.254: v101.35,27.88 101.35,29.78 v100.58,30.54 | v93.15,29.08 93.15,32.77 v93.22,32.83
  Bottom 0.305: v108.33,24.38 v113.6,24.38 | 92.9,28.83 v93.15,29.08
-12V  (via drill 0.4)
  Top 0.305: v172.53,32.45 158.56,32.45 155.19,29.08 155.19,25.65 153.67,24.13 149.29,24.13 147.96,25.46 R12.1 | R38.2 R37.2 62.8,91.19 v62.29,91.19
  Top 0.61: C21.1 v146.81,25.65 147.93,25.65 R12.1
  Bottom 0.305: v172.53,32.45 172.66,32.45 178.37,38.16 178.37,86.87 171.51,93.73 63.18,93.73 62.29,92.84 v62.29,91.19
  Bottom 0.61: v146.81,25.65 147.07,25.91 147.07,32.07 v148.4,33.4
  pour Top (isolate 0.254): 145.03,31.31 145.03,35.5 151.76,35.5 151.76,31.31
AUX_IN  (via drill 0.4)
  Top 0.254: 17.91,70.48 C72.2 | 76.14,32.99 IC17.1 76.07,33.06 76.07,34.16 75.06,35.18 65.91,35.18 v65.34,34.61 65.85,35.12 | v14.8,61.21 ZD3.3 | v63.63,49.97 63.31,49.66 63.31,33.59 v63.75,33.15
  Top 0.406: C72.2 17.79,70.48 14.86,70.48 | 14.86,70.48 R70.1 | ZD3.3 14.86,70.27 14.86,70.48
  Bottom 0.254: v14.8,61.21 17.97,61.21 19.11,60.07 36.96,60.07 40.7,56.33 40.7,52.51 43.5,49.72 63.37,49.72 v63.63,49.97 | v65.34,34.61 65.22,34.61 v63.75,33.15
AUX_USET_SW  (via drill 0.4)
  Top 0.254: IC17.6 78.03,35.67 78.04,35.69 | 78.04,35.69 v65.15,35.69 | v8.45,47.31 35.31,47.31 39.24,43.37 v43.5,43.37 | IC13.4 127.89,46.61 121.47,40.2 v117.54,40.2 | 78.04,35.69 116.65,35.69 v116.97,35.37
  Bottom 0.254: v65.15,35.69 45.4,35.69 43.18,37.91 43.18,43.05 v43.5,43.37 | v8.45,47.31 2.92,52.83 2.92,71.26 LED2.BA | v116.97,35.37 116.97,39.62 v117.54,40.2
CC_ACTIVE  (via drill 0.4)
  Top 0.254: R94.2 R92.1 | 129.86,56.52 IC13.22 | IC13.22 129.84,54.72 128.65,53.53 122.62,53.53 121.47,52.39 121.47,48.13 v121.73,47.88 | Q16.1 134.24,63.31 132.84,61.91 130.68,61.91 129.41,60.64 129.41,60.01 129.86,59.56 129.86,56.54 IC13.22 | 119.83,48.77 R92.1 | v120.08,47.88 120.08,48.52 R92.1
  Bottom 0.254: v121.73,47.88 v120.08,47.88
CC_LED
  Top 0.254: R86.2 10.16,79.95 8.76,78.55 5.75,78.55 LED3.BC
CS_ADC  (via drill 0.4)
  Top 0.254: IC18.2 119.19,30.16 119.83,30.8 v120.21,30.8 | RN1.7 125.79,29.09 v124.08,30.8
  Bottom 0.254: v124.08,30.8 v120.21,30.8
CS_DAC  (via drill 0.4)
  Top 0.254: v122.49,23.18 124.67,25.36 RN1.8 | v98.17,24.96 98.17,25.4 IC16.5
  Bottom 0.254: v98.17,24.96 98.49,24.64 98.49,19.18 99.95,17.72 103.06,17.72 104.39,16.38 115.76,16.38 v122.49,23.18
CS_IOEXP  (via drill 0.4)
  Top 0.254: RN1.6 126.69,34.1 128.46,35.88 v130.05,35.88 | IC13.11 132.46,43.81 130.24,41.59 v130.24,41.4
  Bottom 0.254: v130.05,35.88 129.92,36.01 129.92,41.08 v130.24,41.4
CSA
  Top 0.254: IC4.1 125.09,17.22 125.09,16.7 118.94,16.7 116.84,14.61 IC3.13
CSB
  Top 0.254: IC3.12 118.11,14.61 119.7,16.19 125.35,16.19 125.61,16.45 IC4.2
CURR_5A  (via drill 0.4)
  Top 0.254: Q11.4 v86.66,54.59 86.68,54.61 | R60.2 87.18,64.07 v87.82,64.07 88.52,64.77 103.82,64.77 109.67,58.93 118.94,58.93 122.05,55.82 125.86,55.82 125.98,55.94 125.98,56.5 IC13.28
  Bottom 0.254: v86.66,54.59 86.66,62.91 v87.82,64.07
CURR_50MA
  Top 0.254: 87.06,59.75 Q10.4 86.66,61.58 R54.2 | R54.2 | R54.2 89.34,64.26 103.57,64.26 109.41,58.42 118.68,58.42 121.79,55.31 126.43,55.31 126.59,55.47 IC13.27
CV_ACTIVE  (via drill 0.4)
  Top 0.254: R82.2 118.36,54.73 | 118.36,54.73 R79.1 | Q15.1 130.75,62.74 128.91,60.9 128.91,60.13 | IC13.23 129.21,59.45 128.91,59.75 128.91,60.13 | 128.91,60.13 128.84,60.07 123.64,60.07 v123,60.71 | v118.68,57.28 118.49,57.09 118.49,54.86 118.36,54.73
  Bottom 0.254: v123,60.71 121.22,60.71 118.68,58.17 v118.68,57.28
CV_LED
  Top 0.254: R84.1 9.84,77.98 9.1,77.23 LED3.TC
D_CC
  Top 0.254: R86.1 17.65,79.95 20.77,83.06 48.26,83.06 62.17,69.15 110.05,69.15 111.38,67.82 132.08,67.82 133.22,66.67 Q16.3
D_CV
  Top 0.254: R84.2 16.45,77.98 21.02,82.55 48.01,82.55 61.91,68.64 109.79,68.64 111.12,67.31 129.16,67.31 129.73,66.74 Q15.3
DARL_C  (via drill 0.4)
  other vias: 94.55,91.5 94.55,90.61 94.55,89.73 94.55,88.84 94.55,87.95 94.55,87.06 95.44,91.5 95.44,90.61 95.44,89.73 95.44,88.84 95.44,87.95 95.44,87.06
  pour Top (isolate 0.406, no thermals): 79.69,95 99.06,95 99.06,82.55 98.55,82.04 85.09,82.04 84.77,82.36 84.77,88.77 84.2,89.34 80.26,89.34 79.69,89.92
  pour Bottom (isolate 0.406, no thermals): 85.72,93.47 99.06,93.47 99.06,86.36 98.55,85.85 86.04,85.85 85.72,86.17
DC+  (via drill 0.4)
  Top 0.406: C1.2 166.43,12.89 v166.5,12.95
  Top 0.813: R1.2 164.72,6.19 X1.1
  Bottom 0.406: v166.5,12.95 166.08,13.37
  Bottom 2.54: X1.1 165.41,12.69 166.08,13.37 171.09,18.37 L1.1
DC-  (via drill 0.4)
  Top 0.406: C1.1 v161.29,12.89
  Top 0.813: R1.1 159.12,6.29 X1.2
  Bottom 0.406: v161.29,12.89 160.97,12.89 160.62,12.54
  Bottom 2.54: X1.2 159.91,11.83 160.62,12.54 176.45,28.37 L1.3
DC_OUT  (via drill 0.4)
  Top 0.254: C8.2 164.25,47.15 164.25,47.22 164.53,47.5 164.53,49.66 165.48,50.61 R3.1 | IC1.11 164.25,44.04 164.08,43.85 161.48,43.85 C7.1 | IC2.2 151.51,7.18 151.64,7.05
  Top 0.305: C8.2 164.21,47.18
  Top 0.356: IC1.11 164.25,47.15
  Top 0.406: ZD1.C v155.7,42.48
  Top 0.61: v149.61,3.17 149.61,3.75 149.67,3.81 | C4.2 160.54,19.55 L1.2
  Bottom 0.61: L1.2 161.73,18.09 157.67,14.03 157.67,3.75 157.1,3.17 v149.61,3.17
  Bottom 2.54: 156.91,43.43 155.26,41.78 155.26,29.02 161.73,22.55 L1.2
  other vias: 170.75,47.43 169.23,47.43 169.99,48.51 169.23,48.51 169.23,49.59 169.99,49.59 170.75,49.59 169.99,47.43 170.75,48.51 156.46,42.48 154.94,42.48
  pour Top (isolate 0.305, no thermals): 161.86,56.01 173.42,56.01 174.37,55.05 174.37,48.13 173.74,47.5 173.23,47.05 168.85,47.05 168.85,48.77 168.4,49.15 168.08,49.15 168.08,53.21 167.77,53.53 162.37,53.53 161.86,54.04
  pour Bottom (isolate 0.406, no thermals): 155.45,48.13 166.24,48.13 168.15,50.04 171.7,50.04 171.7,46.48 169.99,44.77 159.83,44.77 156.97,41.91 154.56,41.91 154.56,47.24
  pour Top (isolate 0.305, no thermals): 151.07,9.46 151.83,9.46 151.83,3.17 151.51,2.86 147.76,2.86 147.51,3.11 147.51,7.68 151.07,7.68
DIB_A0  (via drill 0.4)
  Top 0.203: R24.2 106.68,4.45 v106.93,4.19 | IC8.1 99.94,4.32 v100.08,4.19
  Top 0.254: IC8.1 97.91,4.32 v95.38,6.86
  Bottom 0.203: v106.93,4.19 103.63,4.19 103.12,3.68 102.62,3.68 102.11,4.19 v100.08,4.19
  Bottom 0.254: v95.38,6.86 95.12,7.11 77.28,7.11 74.84,9.55 X2.17
DIB_A1  (via drill 0.4)
  Top 0.203: IC8.2 100.71,5.59 100.9,5.4 102.87,5.4 R23.2 103.82,6.73
  Top 0.254: IC8.2 97.78,5.59 95.89,7.49 | 95.89,7.49 95.95,7.49 | v95.5,8.45 95.5,7.87 95.89,7.49
  Bottom 0.254: X2.19 77.41,9.93 77.41,8.95 78.23,8.13 95.19,8.13 v95.5,8.45
DIB_A2  (via drill 0.4)
  Top 0.254: R22.2 101.85,6.86 IC8.3 97.72,6.86 96.58,8 v96.58,8.06
  Bottom 0.254: X2.18 76.14,11.2 76.14,9.27 77.79,7.62 96.14,7.62 v96.58,8.06
DIB_CSA  (via drill 0.4)
  Top 0.254: v116.84,7.37 IC3.4 | v64.33,6.29 67.18,3.43 116.65,3.43 v116.84,3.62
  Bottom 0.254: v116.84,3.62 v116.84,7.37 | v64.33,6.29 64.33,9.61 X2.9
DIB_CSB  (via drill 0.4)  (1 unrouted)
  Top 0.203: IC3.5 v118.11,9.53
  Top 0.254: 67.17,12.5 65.98,11.3 65.98,9.14 66.48,8.64 68.45,8.64 69.28,7.81 89.22,7.81 89.47,8.06 91.12,8.06 92.84,9.78 v106.43,9.78
  Bottom 0.254: v118.11,9.53 115.63,9.53 115.06,10.1 106.74,10.1 v106.43,9.78
DIB_IRQ  (via drill 0.4)  (1 unrouted)
  Top 0.254: v133.22,6.48 IC7.6 | v127.19,6.35 127.19,6.1 v108.78,6.1 | v73.28,5.33 75.75,5.33 v75.82,5.27
  Bottom 0.254: v133.22,6.48 132.84,6.1 127.38,6.1 v127.19,6.35 | 64.72,12.5 65.98,11.24 65.98,6.16 66.8,5.33 v73.28,5.33 | v75.82,5.27 76.2,4.89 89.03,4.89 89.66,5.52 90.74,5.52 91.31,4.95 97.98,4.95 99.19,6.16 108.71,6.16 v108.78,6.1
DIB_MISO  (via drill 0.4)  (1 unrouted)
  Top 0.254: 69.71,12.5 68.52,11.3 68.52,9.27 69.47,8.32 88.96,8.32 89.22,8.57 90.87,8.57 92.9,10.6 v105.6,10.6 | v115.95,10.29 118.49,10.29 119.38,9.4 IC3.6
  Bottom 0.254: v105.6,10.6 115.63,10.6 v115.95,10.29
DIB_MOSI  (via drill 0.4)
  Top 0.254: IC7.3 129.41,6.79 128.21,5.59 109.35,5.59 v108.78,5.02
  Bottom 0.254: X2.15 72.3,7.52 75.44,4.38 89.28,4.38 89.92,5.02 90.55,5.02 91.12,4.45 98.17,4.45 99.38,5.65 108.08,5.65 108.71,5.02 v108.78,5.02
DIB_NRESET
  Top 0.254: IC7.5 131.95,7.68 126.62,2.35 62.29,2.35 55.82,8.83 55.82,11.26 X2.4
DIB_SCL
  Top 0.203: IC8.6 94.17,6.86
  Top 0.254: IC8.6 93.38,7.05 89.98,7.05 89.72,6.79 68.77,6.79 67.94,7.62 61.94,7.62 X2.5
DIB_SCLK
  Top 0.254: IC3.3 115.57,9.59 114.75,10.41 106.93,10.41 105.92,11.43 92.96,11.43 90.61,9.08 88.96,9.08 88.71,8.83 71.37,8.83 70.24,9.96 X2.13
DIB_SDA  (1 unrouted)
  Top 0.254: IC8.5 93.51,8.19 93.15,8.19 92.52,7.56 89.72,7.56 89.47,7.3 69.03,7.3 68.2,8.13 64.39,8.13 63.37,9.14 63.37,11.3 62.18,12.5
DP_S  (via drill 0.4)
  Top 0.305: 59.05,83.63 R28.1
  other vias: 59.12,82.55 59.88,82.55 60.64,82.55 58.36,82.55
  pour Top (isolate 0.406): 57.34,86.11 71.25,86.11 71.82,85.53 71.82,82.42 71.44,82.04 62.04,82.04 61.66,81.66 61.66,79.12 61.59,79.06 57.66,79.06 57.34,79.12
  pour Bottom (isolate 0.305): 57.53,85.98 61.66,85.98 61.66,79.06 57.53,79.06
FB  (via drill 0.4)
  Top 0.254: 165.93,36.89 R11.1 166.21,37.43 166.21,38.1 | 166.21,38.1 IC1.5 | v166.5,38.16 166.27,38.16 166.21,38.1 | v172.09,37.85 R9.2 172.09,35.52 Q2.C 175.64,35.43 C19.1
  Bottom 0.254: v166.5,38.16 171.77,38.16 v172.09,37.85
GCOM  (via drill 0.4)
  Top 0.406: R39.1 70.93,26.74 v71.44,26.23 | IC10.7 IC10.6 81.85,24.9 81.22,25.53 v81.22,26.23 | R52.1 92.08,55.31 v91.89,56.52
  Bottom 0.406: v71.44,26.23 v81.22,26.23 81.47,26.23 82.93,27.69 82.93,37.78 92.08,46.93 92.08,56.33 v91.89,56.52
GND  (via drill 0.4)  (1 unrouted)
  Top 0.254: C55.1 v75.25,28 | C81.1 v114.43,27.43 | C79.1 v113.92,20.64 | v113.35,18.8 C80.1 | C74.1 v108.78,26.67 | C73.1 v108.78,22.73 | C76.1 v108.78,18.8 | C75.2 v108.78,30.61 | IC18.8 115.29,28.35 115.7,27.94 117.73,27.94 v117.92,27.75 | Q21.2 29.08,53.78 | v24.83,73.98 23.96,73.98 Q19.E | v24.96,71.75 R103.1 | v18.8,72.64 C72.1 | IC12.4 122.1,61.61 v122.11,61.59 | 118.64,62.42 C62.1 118.59,61.62 v118.62,61.59 | C48.1 v65.22,19.94 | v65.72,39.12 C85.1 | v114.3,14.8 IC3.15 | IC7.9 135.79,13.72 135.79,14.83 v135.7,14.92 | v122.56,13.78 121.96,13.78 IC3.9 | C78.1 v119.13,18.35 | C77.1 v120.71,18.99 | v98.04,27.94 98.04,27.56 IC16.8 | IC4.4 127.03,17.23 v127.13,17.46 | C46.1 v90.04,61.59 v90.05,61.6 C50.1 | v90.36,59.5 C47.2 | IC20.4 v71.94,39.68 v71.94,39.69 | C84.1 v65.72,46.99 | R83.2 v65.72,43.05 | IC17.2 v74.99,32.32 | Q15.2 v128.59,64.96 | v132.14,65.02 132.14,66.1 Q16.2 | IC13.10 131.8,50.71 v131.64,50.86 | C37.1 v143.7,32.26 | 152.91,4.51 R16.1 | 151.51,11.49 v151.64,11.37 | IC2.9 151.51,16.03 C29.1 151.58,16.29 C33.1 | v142.56,18.29 142.94,19.03 TR1.4 | v146.05,27.3 146.05,28.07 C21.2 | C27.2 143.32,26.42 v142.94,26.8 | R60.1 v84.96,62.8 R54.1 | IC6.5 v149.99,31.49 v149.99,31.5 | IC18.4 117.89,27.78 v117.92,27.75 | IC18.5 117.24,28.43 v117.92,27.75 | IC18.3 118.54,28.37 v117.92,27.75 | Q9.2 83.5,84.96 R51.1 | D10.C v53.66,86.68 | v79.31,40.83 Q17.2 | v51.75,86.17 D9.C | IC13.16 133.76,55.03 v133.79,54.99 | IC13.17 133.1,55.69 v133.79,54.99 | IC13.15 134.39,55.59 v133.79,54.99
  Top 0.279: IC2.9 151.51,11.49
  Top 0.305: ZD3.1 v15.74,73.47 v15.75,73.47 | ZD3.2 13.85,73.41 v13.91,73.47 | v14.41,76.01 13.46,76.01 R74.1 | C49.1 v82.8,19.75 | C56.1 v85.79,27.88 | v85.6,29.72 R36.2 84.96,29.47 84.96,27.98 C39.2 | v79.69,45.78 R90.1 | v46.42,45.78 R91.1 | v80.64,30.86 79.86,30.86 C71.2 | 104.27,57.28 104.2,57.21 | v12.51,37.15 R68.2 | C70.1 92.27,31.62 92.14,31.75 | C65.2 143.04,71.4 v143.06,71.37
  Top 0.406: 29.08,53.78 R106.1 | v26.92,54.67 26.92,53.82 Q21.2 | v128.14,14.86 IC7.15 | v123.7,14.61 123.7,13.8 C36.1 | C67.2 v96.14,32.32 | C69.1 v94.3,31.75 | IC14.4 v101.98,22.42 | C66.- 102.49,24.51 v102.36,24.13 | C64.2 106.43,21.21 v106.11,20.89 | C68.2 v96.14,19.24 | C31.1 v108.9,13.72 | D17.C v41.59,46.55 | C53.1 104.25,57.28 v104.2,58.17 C51.1 | v103.69,61.98 C54.2 | C82.2 v72.77,46.16 | C83.1 v72.52,44.51 | C63.2 v131.51,44.51 | v122.87,18.67 123.74,18.67 C32.2 | R19.1 155.96,10.22 156.4,9.78 156.4,5.21 155.89,4.7 155.32,4.7 C28.2 154.88,4.7 153.03,4.7 R16.1 | R21.1 R19.1 | R19.1 153.48,10.22 | v149.86,26.8 149.86,26.03 C20.2 | v141.67,32.64 D7.C | v81.41,85.6 81.41,85.09 Q9.2 | C87.1 v116.59,44.58 | v111.57,55.88 110.53,55.88 C86.1
  Top 0.61: D6.A v141.67,38.29 | IC15.2 v139.57,73.41
  Top 0.813: v94.3,31.75 92.14,31.75 v91.57,31.75 v89.72,31.75 v86.04,31.75 | v66.74,31.11 v68.52,31.11 | v64.39,25.91 v66.04,25.91 | v113.35,15.56 v113.35,18.8 | v108.78,15.56 v108.78,18.8 | v96.27,47.62 v94.11,47.62 v91.12,47.62 | v125.48,39.81 v127.25,39.81 | v127.89,50.86 v131.64,50.86 | v123.13,56.9 v124.78,56.9
  Bottom 0.254: v84.96,62.8 84.96,62.74
  Bottom 0.305: 14.1,55.18 12.51,53.59 v12.51,37.15
  Bottom 3.81: SH1.2 143.38,85.28
  other vias: 106.87,20.89 102.36,24.89 100.77,19.56 148.4,39.37 103.89,60.33 90.55,57.78 149.22,31.5 148.4,38.61 152.4,11.37 152.4,10.6 151.64,10.6 143.7,26.8 141.8,18.29 145.29,27.3 150.62,26.8 87.76,31.75 143.32,18.29
  pour Top: 94.81,23.81 107.31,23.81 107.31,18.29 94.81,18.29
  pour Bottom (isolate 0.254, rank 2): 13.97,84.52 21.78,84.52 32.26,95 132.52,95 132.52,87.12 144.46,87.12 144.46,49.66 145.99,48.13 152.4,48.13 153.16,47.24 153.16,27.62 156.59,24.19 156.59,3.68 155.77,2.86 138.49,2.86 137.67,3.68 137.67,11.3 136.78,12.19 108.78,12.19 105.73,15.24 57.15,15.24 56.2,16.19 56.2,35.62 57.09,36.51 60.33,36.51 61.21,37.4 61.21,41.91 60.33,42.8 40.45,42.8 39.94,43.31 39.94,49.91 40.45,50.42 49.66,50.42 51.31,52.07 51.31,58.29 51.88,58.86 59.18,58.86 60.07,59.75 60.07,70.36 50.04,80.39 39.24,80.39 31.62,72.71 31.62,55.5 30.48,54.36 14.29,54.36 13.21,55.44 13.21,60.2 12.95,60.45 7.18,60.45 6.86,60.77 6.86,63.18 7.18,63.5 12.95,63.5 13.21,63.75 13.21,83.76
  pour Top (isolate 0.254): 143.19,36.89 143.19,41.08 151.76,41.02 151.76,36.83
  pour Top (isolate 0.254, rank 2, no thermals): 139.45,12.89 153.8,12.89 153.8,9.4 146.88,9.4 146.49,9.02 146.49,2.86 139.95,2.86 138.87,3.94 138.87,12.32
  pour Top (isolate 0.254, no thermals): 135.45,81.09 139.89,81.09 139.89,72.96 135.45,72.96
GNDIO  (via drill 0.4)
  Top 0.254: IC7.2 v128.14,7.18 | v126.11,6.99 C35.2 | 91.16,6.29 C38.1 91.59,5.71 92.08,5.71 | IC8.7 93.57,5.62 93.66,5.71 92.08,5.71 | v92.08,6.16 92.08,5.71 | C30.2 109.77,7.52 v109.79,7.49
  Top 0.406: IC7.8 v135.76,7.18 | IC3.8 v122.56,8.38 | IC3.2 v114.3,9.27
  other vias: 97.85,8.06 53.78,3.68 63.31,4.83 57.4,8.45 127,4.76
  pour Bottom (isolate 0.254): 53.85,13.72 53.09,12.95 53.09,3.68 53.85,2.92 135.25,2.92 136.02,3.68 136.02,9.91 135.25,10.67 108.2,10.67 106.3,12.51 105.09,13.72
  pour Top (isolate 0.254): 53.85,13.72 53.09,12.95 53.09,1.78 53.66,1.21 135.45,1.21 136.02,1.78 136.02,9.91 135.25,10.67 108.2,10.6 105.09,13.72
HOLE_DL  (via drill 3.2 pad 5.5)
  other vias: 11,5.5
HOLE_UL  (via drill 3.2 pad 5.5)
  other vias: 11,89.5
I_MON  (via drill 0.4)
  Top 0.254: 90.61,34.23 89.66,34.23 R57.1 | 90.61,34.23 101.54,34.23 103.19,32.58 R76.1 | v90.61,34.73 90.61,34.23 | IC11.6 v95.44,59.76 v95.44,59.75 96.01,60.32 C58.2 R59.2
  Bottom 0.254: v90.61,34.73 93.28,37.4 93.28,44.07 95.44,46.22 v95.44,59.75
I_SERVO  (via drill 0.4)
  Top 0.254: D12.C 89.34,43.62 90.04,42.93 93.73,42.93 v94.04,43.24 | C52.2 92.39,19.05 92.39,19.11 C57.2 90.23,21.02 89.03,22.23 | 88.48,22.36 88.48,22.33 88.58,22.23 89.03,22.23 | v95.69,45.34 96.46,44.58 107.19,44.58 108.08,45.47 108.08,47.82 112.46,52.2 v112.65,52.2 | 89.03,22.23 v89.03,21.59 | v112.65,57.15 112.65,55.75 R93.1
  Top 0.305: IC10.1 88.48,22.36
  Bottom 0.254: v95.69,45.34 95.31,45.34 94.04,44.07 v94.04,43.24 93.79,42.99 93.79,34.73 92.39,33.34 92.39,24.96 v89.03,21.59 | v112.65,52.2 v112.65,57.15
I_SET
  Top 0.254: R72.1 109.22,25.27 105.16,25.27 101.66,28.77 97.35,28.77 95.89,27.3 95.89,26.1 94.55,24.77 93.73,24.77 | R55.1 92.84,21.02 93.73,21.91 93.73,24.77 | 93.73,24.77 91.82,24.77 90.74,25.84 I_SET.2
IRQ  (via drill 0.4)
  Top 0.254: IC13.20 131.14,53.99 v130.24,53.09 | v128.65,34.16 128.78,34.29 131.76,34.29 133.41,32.64 133.41,15.62 133.22,15.43 IC7.11
  Bottom 0.254: v130.24,53.09 130.24,52.64 128.71,51.12 128.71,34.23 v128.65,34.16
ISENSE+  (1 unrouted)
  Top 0.254: IC11.3 98.75,59.76 96.71,57.72 96.71,55.44 96.58,55.31 96.2,55.31 R53.2 | R52.2 95.95,55.44 R53.2
ISENSE-  (via drill 0.4)
  Top 0.254: 97.98,55.24 R63.2 97.86,55.24 97.85,55.24 97.85,57.98 98.36,58.48 v98.61,58.48 v98.62,58.49 IC11.2 | R59.1 99.95,62.93 98.23,61.21 v98.23,60.52 | C58.1 94.55,62.61 v94.55,62.04
  Bottom 0.254: v94.55,62.04 96.71,62.04 v98.23,60.52 98.61,60.13 v98.61,58.48
L_OUT
  Top 0.254: R7.1 R6.1 | R6.1 174.37,46.35 175.32,47.31 175.32,64.45 171.07,68.71 | R6.1 173.55,42.35 R9.1
  Top 0.406: R4.1 161.04,85.15
  pour Top (isolate 0.406, no thermals): 149.1,72.14 149.1,81.22 150.43,82.55 159.96,82.55 160.85,83.44 160.85,90.68 161.73,91.57 170.75,91.57 171.64,90.68 171.64,69.02 170.75,68.14 162.94,68.14 160.08,70.99 150.24,70.99
LOOP_CTRL  (via drill 0.4)
  Top 0.254: 88.39,46.26 D12.A 91.47,46.26 R40.1 94.05,45.84 95.82,44.07 109.85,44.07 R89.2 | 88.39,46.26 D11.A | v88.46,47.62 88.46,46.32 88.39,46.26 | Q8.1 82.32,91.59 v80.33,89.6 | v89.98,70.42 v79.95,70.42
  Bottom 0.254: v89.98,70.42 89.98,63.69 88.46,62.17 v88.46,47.62 | v79.95,70.42 79.95,71.44 80.33,71.82 v80.33,89.6
MISO  (via drill 0.4)
  Top 0.254: IC18.15 119.19,22.67 119.44,22.42 121.28,22.42 122.11,21.59 v124.71,21.59 | v129.47,21.27 v129.48,21.27 | v129.48,21.27 129.54,21.27 130.75,22.48 v130.75,30.99 | 129.52,21.23 v129.48,21.27 | IC15.4 138.56,67.94 v138.75,67.75 | RN2.7 129.53,21.21 v129.48,21.27 | v138.75,65.72 138.18,65.15 138.18,55.24 134.39,51.46 IC13.14 134.39,42.7 131.76,40.07 v131.25,40.07
  Bottom 0.254: v124.71,21.59 129.16,21.59 v129.48,21.27 | v138.75,67.75 v138.75,65.72 | v131.25,40.07 131.25,39.62 131.57,39.31 131.57,32.96 130.75,32.13 v130.75,30.99
MOSI  (via drill 0.4)
  Top 0.254: IC16.7 99.45,26.87 v99.69,27.11 | IC18.16 119.84,23.94 120.59,23.94 v120.71,23.81 122.17,22.35 v123.95,22.35 | v131.32,41.27 132.21,41.27 133.76,42.82 IC13.13 | v130.42,20.63 v130.43,20.64 v130.44,20.63 RN2.6 | v129.48,22.35 129.98,22.86 129.98,30.67 v129.67,30.99
  Bottom 0.254: v120.71,23.81 120.4,23.5 120.4,21.78 115.51,16.89 104.65,16.89 103.31,18.22 100.2,18.22 99,19.43 99,25.59 99.57,26.16 99.57,26.99 v99.69,27.11 | v123.95,22.35 v129.48,22.35 130.49,21.34 130.49,20.7 v130.43,20.64 | v131.32,41.27 130.49,40.45 130.49,39.62 131.06,39.05 131.06,33.21 129.67,31.81 v129.67,30.99
N$1
  Top 0.254: Q2.E 174.2,37.99 D3.C 173.96,40.17 R6.2
N$2
  Top 0.254: R8.1 C18.1
N$3
  Top 0.254: RN2.4 131.33,16.02 130.68,15.37 IC7.13
N$4
  Top 0.254: IC4.5 126.61,23.58 RN1.3
N$6
  Top 0.254: IC4.7 125.61,22.41 124.89,23.13 RN1.1 124.89,23.32
N$7
  Top 0.254: IC1.8 166.21,45.56 166.56,45.91 168.56,45.91 D1.C 170.27,46 R2.2
N$8
  Top 0.254: C17.1 167.71,36.96 167.71,38.8 166.88,39.62 166.88,40.35 IC1.6 169.6,40.37 R8.2
N$9
  Top 0.254: IC3.11 119.38,14.48 120.59,15.68 128.33,15.68 129.53,16.89 RN2.2
N$11
  Top 0.254: R61.2S 93.73,50.1
  Top 0.406: R56.2 93.56,53.19 94.49,52.26 94.49,50.42 94.17,50.1 93.73,50.1
N$12
  Top 0.254: R68.1 12.51,30.35 11.56,29.4 9.54,29.4 LED1.CC
N$13
  Top 0.254: IC20.7 76.96,42.22 77.47,42.74 77.47,42.93 | 77.47,42.93 77.47,44.71 R85.2 76.01,45.53 | Q17.1 77.53,42.86 77.47,42.93
N$14
  Top 0.254: R49.2 C43.1
N$15
  Top 1.778: Q13.A2 43.5,56.39 41.34,58.55 35.05,58.55 33.27,56.77 R87.2
N$16
  Top 0.254: IC16.4 92.41,25.58 91.06,26.92 I_SET.1 90.42,26.8
N$17
  Top 0.406: R70.2 R71.1
N$18
  Top 0.508: R80.1 48.36,50.67 Q14.C
  Top 0.61: Q14.C 48.51,54.17 Q13.G
N$19
  Top 0.61: Q14.E 49.46,45.91 R91.2
N$20
  Top 0.406: D17.A D16.C
N$21  (via drill 0.4)
  Top 0.254: v75.25,47.43 76.13,47.43 R85.1 R90.2
  Top 0.406: D16.A 43.53,47.5 v47.5,47.5 47.56,47.56 Q14.B
  Bottom 0.254: v47.5,47.5 47.88,47.5 49.02,48.64 63.06,48.64 63.69,48.01 74.68,48.01 v75.25,47.43
N$22
  Top 0.254: IC4.6 126.11,22.8 125.79,23.11 RN1.2
N$23
  Top 0.254: IC1.9 165.56,45.67 166.18,46.29 C8.1
N$25
  cutout Bottom: 59.25,59.56 59.25,76.14 59.5,76.39 61.34,76.39 61.59,76.14 61.59,64.45 75.06,64.45 92.9,82.3 99.69,82.3 103.7,86.3 123.57,86.3 124.46,85.41 124.46,82.49 123.95,81.98 122.49,81.98 120.21,79.69 120.21,78.99 118.75,77.53 95.12,77.53 77.15,59.56
N$26
  Top 0.61: C25.2 145.35,13.04 R15.2
N$27
  Top 0.254: IC1.4 165.56,38.3 164.34,37.08 C9.2
N$29
  Top 0.61: FB3.P$1 139.91,36.68 141.23,35.36 D7.A 141.73,35.3 143.7,35.3 | IC6.1 143.7,35.3 | C37.2 143.7,35.3
N$30
  pour Top (isolate 0.305, no thermals): 163.58,44.32 163.13,44.32 162.12,45.34 159.26,45.34 157.92,46.67 157.92,48.13 161.42,48.13 163.58,45.97
N$31
  Top 0.254: R88.2 68.64,40.58 | 68.64,40.58 C85.2 | IC20.3 69.02,40.95 68.64,40.58
N$32
  Top 0.406: X3.1 9.35,64.64 R71.2
N$33
  Top 0.254: IC20.2 69.47,42.22 R83.1 R78.2 C84.2
N$34
  Top 0.254: IC2.3 152.02,7.68 152.91,6.79 R16.2 151.26,4.51 151.01,4.51 R13.1
N$35
  Top 0.406: R47.1 80.07,87.76 79.95,87.63 79.95,84.2 79.88,84.14 Q9.3
N$36
  Top 0.254: IC16.3 92.53,26.21 90.36,28.38 U_SET.1
N$37
  Top 0.254: C52.1 R58.1
N$38  (1 unrouted)
  Top 1.27: C12.2 159.32,63.25
N$39
  Top 0.305: Q6.1 65.3,92.73 R35.1 R37.1
N$40  (via drill 0.4)
  Top 0.61: R34.2 v103,89.72
  Bottom 0.61: Q4.1 123.06,85.15 119.63,88.58 104.14,88.58 v103,89.72
N$41
  Top 0.254: IC2.4 152.53,7.94 153.16,7.3 154.11,7.3 155,6.41 C28.1
N$42  (via drill 0.4)
  Top 0.254: v123.13,64.9 123.13,62.8 124.47,61.45 Q12.3 | v122.43,68.58 122.17,68.33 111.63,68.33 110.3,69.66 62.36,69.66 56.39,75.63 v56.39,76.07 | 56.39,78.55 v56.39,78.11 56.39,79.12 55.56,79.95 R69.2
  Bottom 0.254: v56.39,76.07 v56.39,78.11 | v123.13,64.9 123.13,67.88 v122.43,68.58
N$43  (via drill 0.4)
  Top 0.61: R33.2 101.79,87.5 v102.55,86.74
  Bottom 0.61: v102.55,86.74 108.33,86.74 109.73,85.34 Q3.1
N$45
  Top 0.305: C40.2 47.69,90.27 Q7.C | Q7.C 47.34,90.3 | Q7.C 47.67,91.1 48.9,92.33 62.99,92.33 R35.2
N$47
  Top 0.406: Q8.3 84.19,86.97 R47.2
N$48
  Top 0.254: R19.2 153.04,8.32 153.03,8.32 153.03,8.85 IC2.5
N$49
  Top 0.305: R31.2 R27.1
N$50
  Top 0.254: IC2.8 152.02,14.22 153.41,15.62 C29.2 | 153.42,15.69 C29.2 | C29.2 153.48,16.26 153.35,16.38 | R20.2 153.48,16.2 C29.2
N$51
  Top 0.254: C33.2 155.45,18.16 R20.1
N$52  (via drill 0.4)
  Top 0.254: IC4.3 126.11,16.45 126.3,16.26 127.7,16.26 v127.95,16.51 | v127.57,19.49 127.57,23.64 RN1.4
  Bottom 0.254: v127.95,16.51 127.95,19.11 v127.57,19.49
N$55
  Top 0.254: R41.2 47.69,85.47 C40.1
  Top 0.305: C40.1 49.59,89.07 Q7.B 52.74,89.35 D10.A
N$56
  Top 0.254: IC12.6 121.14,65.04 120.21,65.98 117.47,65.98 116.2,64.71 R66.2 116.17,64.36 D15.A D14.A
N$60
  Top 0.254: IC2.1 151.03,8.47 151,8.45 149.57,8.45 C24.2
N$61
  Top 0.254: RN2.3 130.44,16.32 129.41,15.3 IC7.14
N$62
  Top 0.254: IC2.7 152.53,13.97 152.84,14.29 154.87,14.29 R21.2 156.08,14.16 156.21,14.16 156.72,14.67 156.72,18.93 R18.1
N$70  (via drill 0.4)
  Top 0.254: 116.71,20.64 C79.2 116.52,20.66 116.52,21.65 117.24,22.37 IC18.12
  Top 0.305: C80.2 116.55,19.08 C79.2 117.44,21.53 v117.54,21.53 | 121.67,27.18 R77.2
  Top 0.406: 116.27,18.48 C80.2 116.27,18.29 | v120.65,26.67 121.54,26.67 R77.2
  Bottom 0.406: v120.65,26.67 119.76,26.67 119.19,26.1 119.19,23.24 117.54,21.59 v117.54,21.53
N$71
  Top 0.254: IC14.5 96.14,22.42 C68.1
N$72
  Top 0.254: R72.2 C73.2 112.01,22.42 115.76,22.42 115.94,22.59 IC18.10
N$73
  Top 0.254: C76.2 R75.2 112.84,21.91 116.01,21.91 116.59,22.48 IC18.11
N$79
  Top 0.254: Q2.B 176.09,34.48 | 176.09,34.48 C19.2 | 176.09,34.48 176.98,34.48 177.55,35.05 177.55,37.24 D3.A 176.34,38.45 R7.2 176.66,40.58 177.48,41.4 177.48,44.96 R10.1
N$80
  Top 0.254: C74.2 R73.2 111.69,29.14 111.7,29.15 113.67,29.15 114.94,30.42 115.82,30.42 115.95,30.29 IC18.7
N$81